# Altium schematic sheet other.SchDoc
size A4
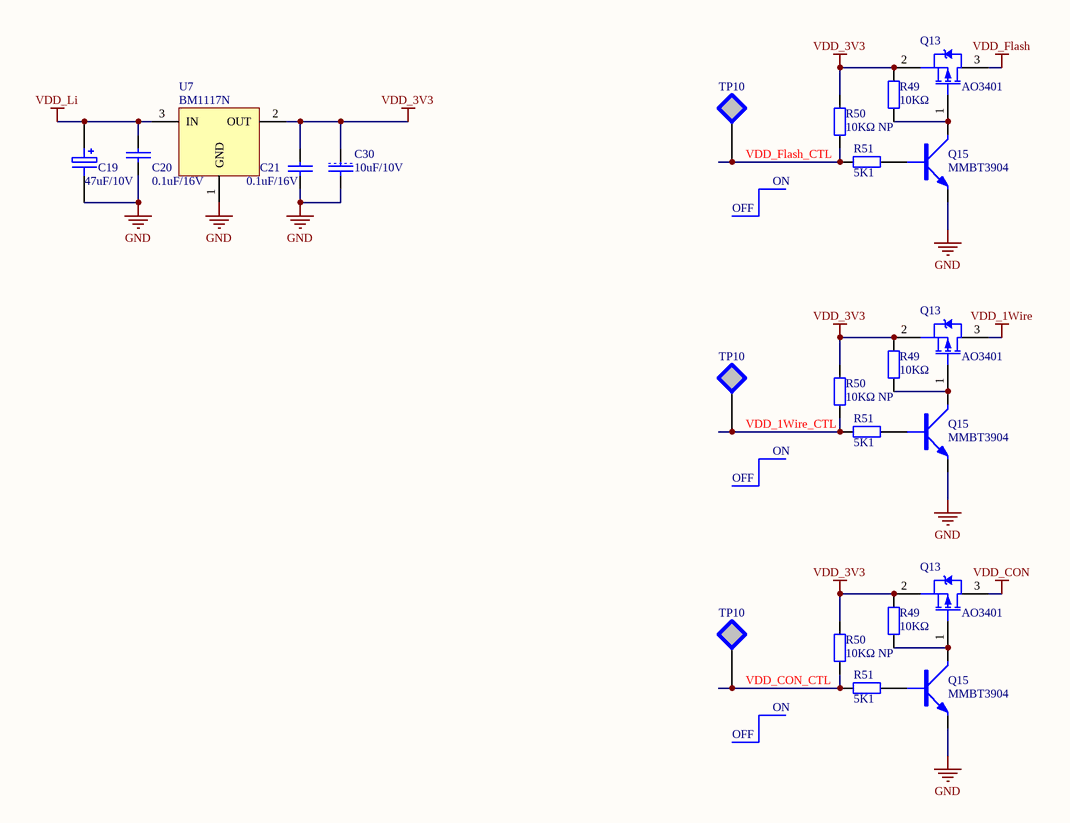
[diagram p0: other.SchDoc]

## Parts
(Parts that share a designator on the sheet are numbered #1, #2 ... from top to bottom, then left to right.)
C19  47uF/10V  [3528]
C20  0.1uF/16V  [0603]
C21  0.1uF/16V  [0603]
C30  10uF/10V  [0805]
Q13#1  AO3401  [SOT23]
Q13#2  AO3401  [SOT23]
Q13#3  AO3401  [SOT23]
Q15#1  MMBT3904  [SOT23]
Q15#2  MMBT3904  [SOT23]
Q15#3  MMBT3904  [SOT23]
R49#1  10KΩ  [0603]
R49#2  10KΩ  [0603]
R49#3  10KΩ  [0603]
R50#1  10KΩ NP  [0603]
R50#2  10KΩ NP  [0603]
R50#3  10KΩ NP  [0603]
R51#1  5K1  [0603]
R51#2  5K1  [0603]
R51#3  5K1  [0603]
TP10#1  (no value)  [TP-PAD1]  (no BOM)
TP10#2  (no value)  [TP-PAD1]  (no BOM)
TP10#3  (no value)  [TP-PAD1]  (no BOM)
U7  BM1117N  [TO-252]

## Nets
GND: C19.2 C20.2 C21.2 C30.2 Q15#1.2 Q15#2.2 Q15#3.2 U7.1(GND)
VDD_1Wire: Q13#2.3(D)
VDD_3V3: C21.1 C30.1 Q13#1.2(S) Q13#2.2(S) Q13#3.2(S) R49#1.2 R49#2.2 R49#3.2 R50#1.2 R50#2.2 R50#3.2 U7.2(OUT)
VDD_CON: Q13#3.3(D)
VDD_Flash: Q13#1.3(D)
VDD_Li: C19.1 C20.1 U7.3(IN)
VDD_1Wire_CTL: R50#2.1 R51#2.2 TP10#2.1
VDD_CON_CTL: R50#3.1 R51#3.2 TP10#3.1
VDD_Flash_CTL: R50#1.1 R51#1.2 TP10#1.1
NetQ13#1_1: Q13#1.1(G) Q15#1.3 R49#1.1
NetQ13#2_1: Q13#2.1(G) Q15#2.3 R49#2.1
NetQ13#3_1: Q13#3.1(G) Q15#3.3 R49#3.1
NetQ15#1_1: Q15#1.1 R51#1.1
NetQ15#2_1: Q15#2.1 R51#2.1
NetQ15#3_1: Q15#3.1 R51#3.1

## Notes on the sheet
- ON
- OFF

## Library data of the parts
C19 = ELECTRO1: 贴片陶瓷电容; Kind: 直插电解电容
C20 C21 C30 = CAP: 贴片陶瓷电容; Kind: 贴片陶瓷电容
  C30: Author: 叶建峰
Q13#1-Q13#3 = DMP3098L: -30V,-3.8A   PMOS  70-120mΩ; Manufacturer: DIODES; Kind: 贴片MOS管; Remark: 关键元器件
Q15#1-Q15#3 = 9013: NPN三极管; Kind: 贴片三极管
R49#1-R49#3 R50#1-R50#3 R51#1-R51#3 = RES_0603: RES 10KΩ 1/10w  5% SMT 0603; OEMs: *; Type: 10KΩ; Package: 0603
TP10#1-TP10#3 = TESTPOINT: Test Point; Author: 叶建峰
U7 = AZ1084